# Altium schematic sheet Manimohan05_Linear-Power-supply__Sheet_1_2023-05-23.schdoc
size 215 x 110 mm
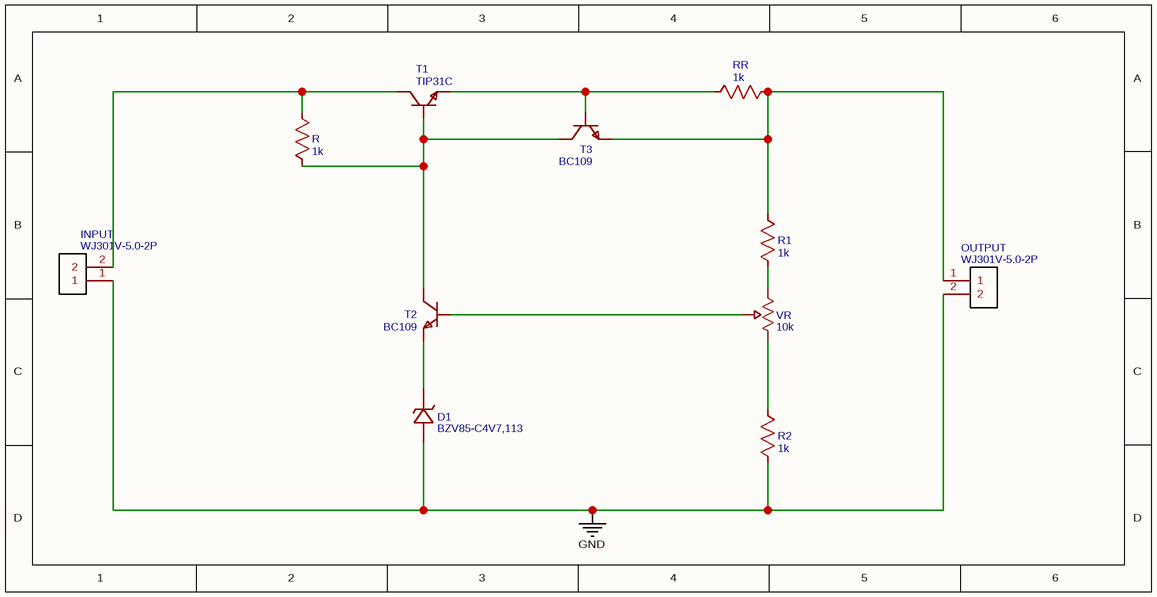
[diagram p0: Manimohan05_Linear-Power-supply__Sheet_1_2023-05-23.schdoc]

## Parts
D1  BZV85-C4V7,113  [DO-41_BD2.4-L4.7-P8.70-D0.9-RD]
INPUT  WJ301V-5.0-2P  [CONN-TH_2P-P5.00_WJ301V-5.00-2P]
OUTPUT  WJ301V-5.0-2P  [CONN-TH_2P-P5.00_WJ301V-5.00-2P]
R  1k  [R_AXIAL-0.4]
R1  1k  [R_AXIAL-0.4]
R2  1k  [R_AXIAL-0.4]
RR  1k  [R_AXIAL-0.4]
T1  TIP31C  [TO-220-3_L10.0-W4.5-P2.54-T]
T2  BC109  [TO-92-3_L4.6-W3.6-P1.30-L_2N3904]
T3  BC109  [TO-92-3_L4.6-W3.6-P1.30-L_2N3904]
VR  10k  [RES-ADJ-TH_3296W-L]

## Nets
GND: D1.2(A) INPUT.1 OUTPUT.2 R2.2
NetD1_1: D1.1(K) T2.1(E)
NetINPUT_2: INPUT.2 R.1 T1.2(C)
NetOUTPUT_1: OUTPUT.1 R1.1 RR.2 T3.1(E)
NetR1_2: R1.2 VR.1
NetR2_1: R2.1 VR.2
NetR_2: R.2 T1.1(B) T2.3(C) T3.3(C)
NetRR_1: RR.1 T1.3(E) T3.2(B)
NetT2_2: T2.2(B) VR.3

## Library data of the parts
D1 = BZV85-C4V7,113: BOM_Manufacturer: Nexperia(安世); Contributor: LCSC; BOM_Supplier: LCSC; BOM_Supplier Part: C550487; BOM_Manufacturer Part: BZV85-C4V7,113; BOM_JLCPCB Part Class: Extended Part; spicePre: D; spiceSymbolName: BZV85-C4V7,113
INPUT OUTPUT = WJ301V-5.0-2P: BOM_Manufacturer: KANGNEX(康奈克斯电气); BOM_Supplier: LCSC; BOM_Manufacturer Part: WJ301V-5.0-2P; BOM_Supplier Part: C8475; BOM_JLCPCB Part Class: Extended Part; spicePre: P; spiceSymbolName: WJ301V-5.0-2P
R R1 R2 RR = 1k: nameAlias: Value(Ω); Contributor: LCEDA_Lib; spicePre: R; spiceSymbolName: R_0603_US
T1 = TIP31C: BOM_Manufacturer: ST(意法半导体); BOM_Supplier: LCSC; BOM_Manufacturer Part: TIP31C; BOM_Supplier Part: C13506; BOM_JLCPCB Part Class: Extended Part; spicePre: Q; spiceSymbolName: TIP31C
T2 T3 = BC109: Contributor: tcc.0292.2020; BOM_Manufacturer Part: BC109; spicePre: Q; spiceSymbolName: BC109
VR = 10k: BOM_Manufacturer: AMPHENOL PIHER SENSORS AND CONTROLS; BOM_Manufacturer Part: PT15NV15-103A2020-E-S; nameAlias: Value; Power: 1/4W; Tolerance: ±20%; Contributor: Prof. Ing. F. Scordino; BOM_Supplier Part: 3128548; BOM_Supplier: Element14; link: http://www.farnell.com/datasheets/2661580.pdf?_ga=2.71859414.49542392.1561472054-1799350803.1561127279&_gac=1.195825304.1561361032.EAIaIQobChMIz6jKi8uB4wIV1uF3Ch1b0wY1EAAYASAAEgKCbfD_BwE; spicePre: R; spiceSymbolName: POT_WITHOUT HEAD